# Altium schematic sheet flash.SchDoc
size A4
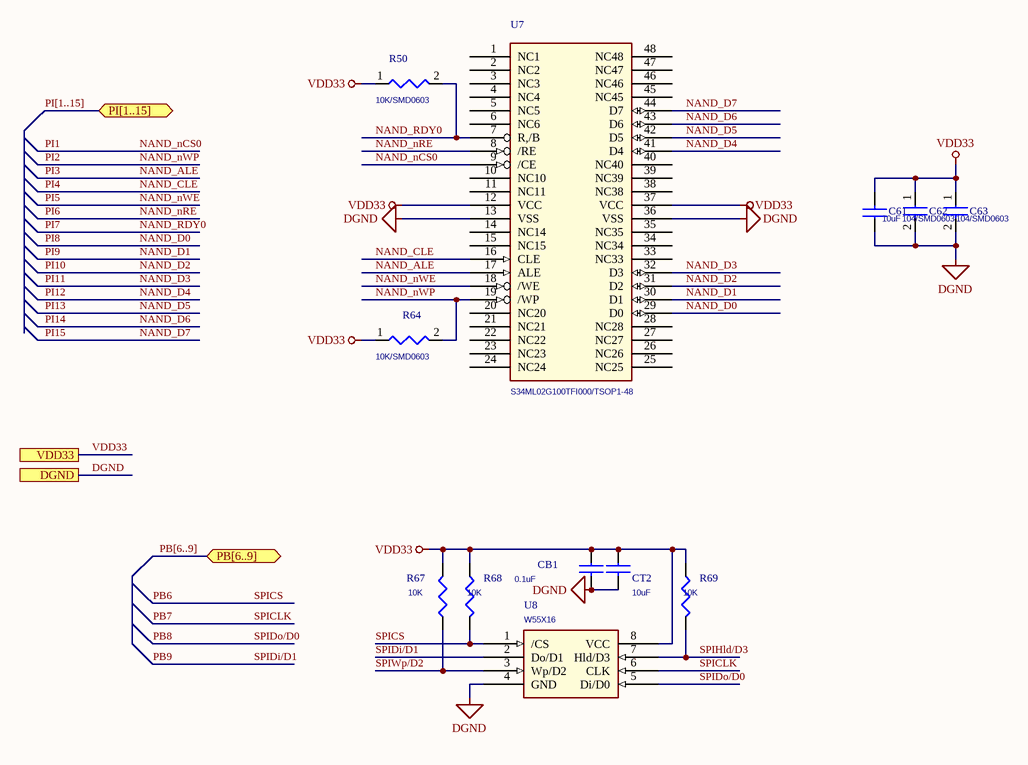
[diagram p0: flash.SchDoc]

## Parts
C61  10uF  [C0805]
C62  104/SMD0603  [0603C]
C63  104/SMD0603  [0603C]
CB1  0.1uF  [0603C]
CT2  10uF  [C0805]
R50  10K/SMD0603  [0603R]
R64  10K/SMD0603  [0603R]
R67  10K  [0603R]
R68  10K  [0603R]
R69  10K  [0603R]
U7  S34ML02G100TFI000/TSOP1-48  [TSOP48-0.5MM]
U8  W55X16  [VDFPN8]

## Ports
DGND, PB[6..9], PI[1..15], VDD33

## Nets
DGND: C61.1 C62.2 C63.2 CB1.2 CT2.2 U7.13(VSS) U7.36(VSS) U8.4(GND) ; port DGND
VDD33: C61.2 C62.1 C63.1 CB1.1 CT2.1 R50.1 R64.1 R67.2 R68.2 R69.2 U7.12(VCC) U7.37(VCC) U8.8(VCC) ; port VDD33
NAND_ALE: U7.17(ALE)  [also labelled PI3]
NAND_CLE: U7.16(CLE)  [also labelled PI4]
NAND_D0: U7.29(D0)  [also labelled PI8]
NAND_D1: U7.30(D1)  [also labelled PI9]
NAND_D2: U7.31(D2)  [also labelled PI10]
NAND_D3: U7.32(D3)  [also labelled PI11]
NAND_D4: U7.41(D4)  [also labelled PI12]
NAND_D5: U7.42(D5)  [also labelled PI13]
NAND_D6: U7.43(D6)  [also labelled PI14]
NAND_D7: U7.44(D7)  [also labelled PI15]
NAND_nCS0: U7.9(/CE)  [also labelled PI1]
NAND_nRE: U7.8(/RE)  [also labelled PI6]
NAND_nWE: U7.18(/WE)  [also labelled PI5]
NAND_nWP: R64.2 U7.19(/WP)  [also labelled PI2]
NAND_RDY0: R50.2 U7.7(R,/B)  [also labelled PI7]
PB6: R68.1 U8.1(/CS)  [also labelled SPICS]
PB7: U8.6(CLK)  [also labelled SPICLK]
PB8: U8.5(Di/D0)  [also labelled SPIDo/D0]
PB9: U8.2(Do/D1)  [also labelled SPIDi/D1]
SPIHld/D3: R69.1 U8.7(Hld/D3)
SPIWp/D2: R67.1 U8.3(Wp/D2)

Not connected (* = marked no-connect by the designer): U7 1(NC1) 2(NC2) 3(NC3) 4(NC4) 5(NC5) 6(NC6) 10(NC10) 11(NC11) 14(NC14) 15(NC15) 20(NC20) 21(NC21) 22(NC22) 23(NC23) 24(NC24) 25(NC25) 26(NC26) 27(NC27) 28(NC28) 33(NC33) 34(NC34) 35(NC35) 38(NC38) 39(NC39) 40(NC40) 45(NC45) 46(NC46) 47(NC47) 48(NC48)

## Buses and harness runs
bus PB[6..9] = port PB[6..9]
bus PI[1..15] = port PI[1..15]

## Library data of the parts
C61 CB1 CT2 = CAP NP_Dup1
C62 C63 = C/SMD0603
R50 R64 = R/SMD0603
R67-R69 = R_Dup1
U8 = W55X10_2